# EAGLE design superior-no-branding (EAGLE 9.6.2)
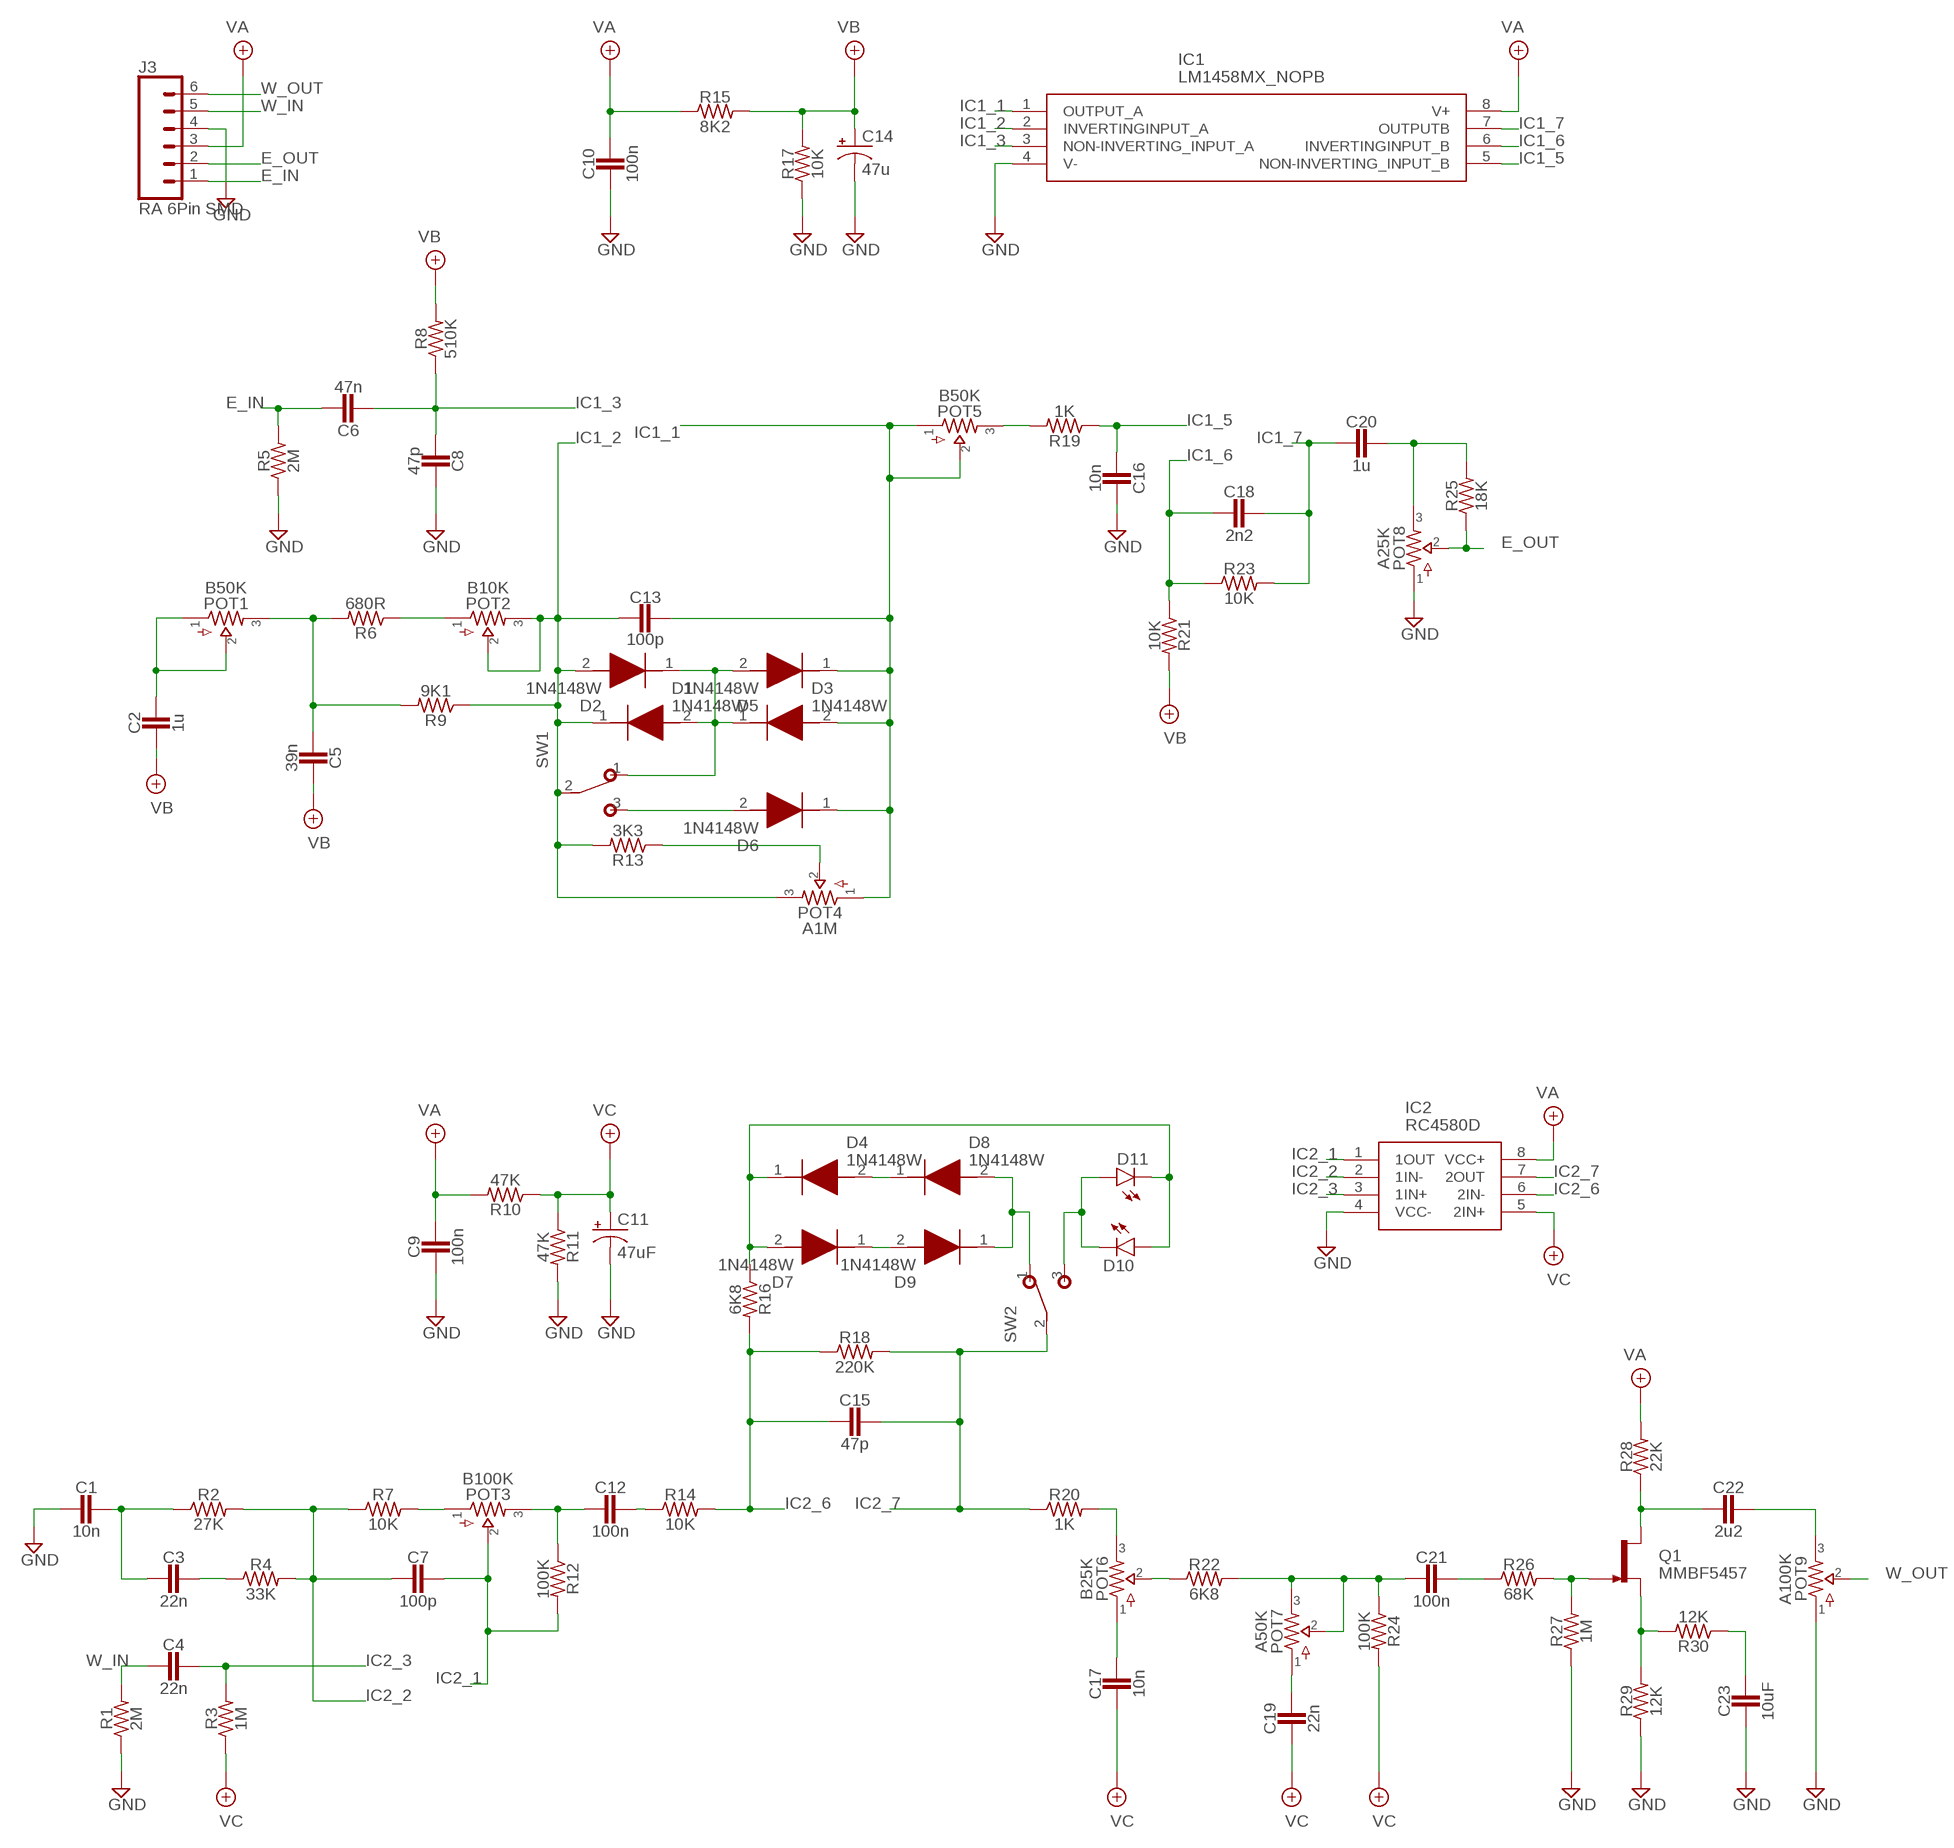
[diagram p0: schematic, sheet 1]

## Parts
C1  10n  CAP0603  [0603]
C2  1u  CAP0805  [0805]
C3  22n  CAP0603  [0603]
C4  22n  CAP0805  [0805]
C5  39n  CAP0603  [0603]
C6  47n  CAP1206  [1206]
C7  100p  CAP0603  [0603]
C8  47p  CAP0603  [0603]
C9  100n  CAP0603  [0603]
C10  100n  CAP0603  [0603]
C11  47uF  0501  [050_020_1]
C12  100n  CAP1206  [1206]
C13  100p  CAP.3  [0.2".MED]
C14  47u  0501  [050_020_1]
C15  47p  CAP0603  [0603]
C16  10n  CAP0603  [0603]
C17  10n  CAP0603  [0603]
C18  2n2  CAP0603  [0603]
C19  22n  CAP0603  [0603]
C20  1u  CAP1206  [1206]
C21  100n  CAP1206  [1206]
C22  2u2  CAP1206  [1206]
C23  10uF  CAP1206  [1206]
D1  1N4148W  [SODFL3816X120N]
D2  1N4148W  [SODFL3816X120N]
D3  1N4148W  [SODFL3816X120N]
D4  1N4148W  [SODFL3816X120N]
D5  1N4148W  [SODFL3816X120N]
D6  1N4148W  [SODFL3816X120N]
D7  1N4148W  [SODFL3816X120N]
D8  1N4148W  [SODFL3816X120N]
D9  1N4148W  [SODFL3816X120N]
D10  LED3MM  [LED3MM]
D11  LED3MM  [LED3MM]
IC1  LM1458MX_NOPB  [SOIC127P600X175-8N]
IC2  RC4580D  NE5532DR  [SOIC127P600X175-8N]
J3  RA 6Pin SMD  CONN_06SILK_FEMALE_PTH  [1X06]
POT1  B50K  16MM.1  [16MM_B.MOUNT]
POT2  B10K  TRIMMER  [TRIM1]
POT3  B100K  16MM.1  [16MM_B.MOUNT]
POT4  A1M  16MM.1  [16MM_B.MOUNT]
POT5  B50K  16MM.1  [16MM_B.MOUNT]
POT6  B25K  16MM.1  [16MM_B.MOUNT]
POT7  A50K  16MM.1  [16MM_B.MOUNT]
POT8  A25K  16MM.1  [16MM_B.MOUNT]
POT9  A100K  16MM.1  [16MM_B.MOUNT]
Q1  MMBF5457  JFET  [SOT23-DGS]
R1  2M  RESISTOR0603  [0603]
R2  27K  RESISTOR0603  [0603]
R3  1M  RESISTOR0603  [0603]
R4  33K  RESISTOR0603  [0603]
R5  2M  RESISTOR0603  [0603]
R6  680R  RESISTOR0603  [0603]
R7  10K  RESISTOR0603  [0603]
R8  510K  RESISTOR0603  [0603]
R9  9K1  RESISTOR0603  [0603]
R10  47K  RESISTOR0603  [0603]
R11  47K  RESISTOR0603  [0603]
R12  100K  RESISTOR0603  [0603]
R13  3K3  RESISTOR0603  [0603]
R14  10K  RESISTOR0603  [0603]
R15  8K2  RESISTOR0603  [0603]
R16  6K8  RESISTOR0603  [0603]
R17  10K  RESISTOR0603  [0603]
R18  220K  RESISTOR0603  [0603]
R19  1K  RESISTOR0603  [0603]
R20  1K  RESISTOR0603  [0603]
R21  10K  RESISTOR0603  [0603]
R22  6K8  RESISTOR0603  [0603]
R23  10K  RESISTOR0603  [0603]
R24  100K  RESISTOR0603  [0603]
R25  18K  RESISTOR0603  [0603]
R26  68K  RESISTOR0603  [0603]
R27  1M  RESISTOR0603  [0603]
R28  22K  RESISTOR0603  [0603]
R29  12K  RESISTOR0603  [0603]
R30  12K  RESISTOR0603  [0603]
SW1  SPDT  [M9040P]
SW2  SPDT  [M9040P]

## Nets
E_IN: C6.1 J3.1 R5.2
E_OUT: J3.2 POT8.2 R25.1
GND: C1.2 C8.1 C9.2 C10.2 C11.- C14.- C16.1 C23.2 IC1.4(V-) IC2.4(VCC-) J3.4 POT8.1 POT9.1 R1.1 R5.1 R11.2 R17.1 R27.1 R29.1
IC1_1: C13.1 D3.2(A) D5.1(K) D6.1(K) IC1.1(OUTPUT_A) POT4.1 POT5.1 POT5.2
IC1_2: C13.2 D1.1(K) D2.2(A) IC1.2(INVERTINGINPUT_A) POT2.2 POT2.3 POT4.3 R9.1 R13.2 SW1.2(P)
IC1_3: C6.2 C8.2 IC1.3(NON-INVERTING_INPUT_A) R8.1
IC1_5: C16.2 IC1.5(NON-INVERTING_INPUT_B) R19.1
IC1_6: C18.2 IC1.6(INVERTINGINPUT_B) R21.1 R23.1
IC1_7: C18.1 C20.2 IC1.7(OUTPUTB) R23.2
IC2_1: C7.1 IC2.1(1OUT) POT3.2 R12.2
IC2_2: C7.2 IC2.2(1IN-) R2.2 R4.2 R7.1
IC2_3: C4.1 IC2.3(1IN+) R3.2
IC2_6: C15.2 IC2.6(2IN-) R14.2 R16.2 R18.1
IC2_7: C15.1 IC2.7(2OUT) R18.2 R20.1 SW2.2(P)
N$5: C5.2 POT1.3 R6.2 R9.2
N$6: POT4.2 R13.1
N$7: C2.1 POT1.1 POT1.2
N$9: POT2.1 R6.1
N$10: D1.2(A) D2.1(K) D3.1(K) D5.2(A) SW1.1(O)
N$12: D6.2(A) SW1.3(S)
N$13: C3.1 R4.1
N$14: POT5.3 R19.2
N$16: C1.1 C3.2 R2.1
N$18: C12.2 POT3.3 R12.1
N$20: C20.1 POT8.3 R25.2
N$21: C12.1 R14.1
N$22: D4.1(K) D7.2(A) D10.A D11.K(C) R16.1
N$23: D4.2(A) D8.1(K)
N$25: D7.1(K) D9.2(A)
N$26: POT6.3 R20.2
N$27: POT6.2 R22.1
N$28: C17.1 POT6.1
N$29: C21.2 POT7.2 POT7.3 R22.2 R24.1
N$30: C21.1 R26.1
N$31: Q1.G R26.2 R27.2
N$32: Q1.S R29.2 R30.2
N$33: C23.1 R30.1
N$34: C22.2 Q1.D R28.1
N$35: C22.1 POT9.3
N$36: D8.2(A) D9.1(K) SW2.1(O)
N$37: D10.K(C) D11.A SW2.3(S)
N$39: C19.1 POT7.1
N$40: POT3.1 R7.2
VA: C9.1 C10.1 IC1.8(V+) IC2.8(VCC+) J3.3 R10.2 R15.1 R28.2
VB: C2.2 C5.1 C14.+ R8.2 R15.2 R17.2 R21.2
VC: C11.+ C17.2 C19.2 IC2.5(2IN+) R3.1 R10.1 R11.1 R24.2
W_IN: C4.2 J3.5 R1.2
W_OUT: J3.6 POT9.2

## Library data of the parts
C1-C10 C12 C15-C23 = superior-no-branding:CAP
C11 C14 = superior-no-branding:050: 0.22 - 100uF Xicon values at Mouser.com: 10V: 10 - 100uF; 16V: 2.2 - 47uF; 25V: 0.47 - 47uF; 50V: 0.22 - 22uF
C13 = superior-no-branding:CAP*?: For Ceramic, Film, MLCC caps
D1-D9 = superior-no-branding:1N4148W: Rectifier Diode Small Signal Switching 100V 0.15A 4ns 2-Pin SOD-123F T/R Source: Datasheet <https://diotec.com/request/datasheet/1n4148w.pdf>; DESCRIPTION: Rectifier Diode Small Signal Switching 100V 0.15A 4ns 2-Pin SOD-123F T/R; HEIGHT: 1.2mm; MANUFACTURER_NAME: Diotec; MANUFACTURER_PART_NUMBER: 1N4148W; MOUSER_PART_NUMBER: 637-1N4148W; MOUSER_PRICE-STOCK: https://www.mouser.co.uk/ProductDetail/Diotec-Semiconductor/1N4148W?qs=OlC7AqGiEDmsbkbAeXQtXg%3D%3D
D10 D11 = superior-no-branding:LED
IC1 = superior-no-branding:LM1458MX_NOPB: Dual 36V general-purpose operational amplifier Source: Datasheet <http://www.ti.com/lit/gpn/lm1458>; DESCRIPTION: Dual 36V general-purpose operational amplifier; HEIGHT: 1.75mm; MANUFACTURER_NAME: Texas Instruments; MANUFACTURER_PART_NUMBER: LM1458MX/NOPB; MOUSER_PART_NUMBER: 926-LM1458MX/NOPB; MOUSER_PRICE-STOCK: https://www.mouser.co.uk/ProductDetail/Texas-Instruments/LM1458MX-NOPB?qs=X1J7HmVL2ZEdp3OcgROSyw%3D%3D
IC2 = superior-no-branding:NE5532DR: NE5532DR, Dual Operational Amplifier 10MHz, 8-Pin SOIC Source: Datasheet <http://www.ti.com/lit/ds/symlink/ne5532.pdf>; DESCRIPTION: NE5532DR, Dual Operational Amplifier 10MHz, 8-Pin SOIC; HEIGHT: 1.75mm; MANUFACTURER_NAME: Texas Instruments; MANUFACTURER_PART_NUMBER: NE5532DR; MOUSER_PART_NUMBER: 595-NE5532DR; MOUSER_PRICE-STOCK: https://www.mouser.co.uk/ProductDetail/Texas-Instruments/NE5532DR?qs=LzFo6vGRJ4tu9UjwVgwNUQ%3D%3D
J3 = superior-no-branding:CONN_06: Multi connection point. Often used as Generic Header-pin footprint for 0.1 inch spaced/style header connections On any of the 0.1 inch spaced packages, you can populate with these: Break Away Headers - Straight <https://www.sparkfun.com/products/116> (PRT-00116) Break Away Male Headers - Right Angle <https://www.sparkfun.com/products/553> (PRT-00553) Female Headers <https://www.sparkfun.com/products/115> (PRT-00115) Break Away Headers - Machine Pin <https://www.sparkfun.com/products/117> (PRT-00117) Break Away Female Headers - Swiss Machine Pin <https://www.sparkfun.com/products/743> (PRT-00743) Arduino Stackable Header - 6 Pin <https://www.sparkfun.com/products/9280> (PRT-09280) For SCREWTERMINALS and SPRING TERMINALS visit here: Screw Terimnals on SparkFun.com <https://www.sparkfun.com/search/results?term=Screw+Terminals> (5mm/3.5mm/2.54mm spacing) This device is also useful as a general connection point to wire up your design to another part of your project. Our various solder wires solder well into these plated through hole pads. Hook-Up Wire - Assortment (Stranded, 22 AWG) <https://www.sparkfun.com/products/11375> (PRT-11375) Hook-Up Wire - Assortment (Solid Core, 22 AWG) <https://www.sparkfun.com/products/11367> (PRT-11367) View the entire wire category on our website here <https://www.sparkfun.com/categories/141>; PROD_ID: CONN-11293; SF_ID: GPS-00579
POT1 POT3-POT9 = superior-no-branding:16MM: 16mm Poteniometers
POT2 = superior-no-branding:TRIMMER: Trimpots
Q1 = superior-no-branding:JFET
R1-R30 = superior-no-branding:RESISTOR
SW1 SW2 = superior-no-branding:SPDT: TOGGLE SWITCH Marquardt

## Board
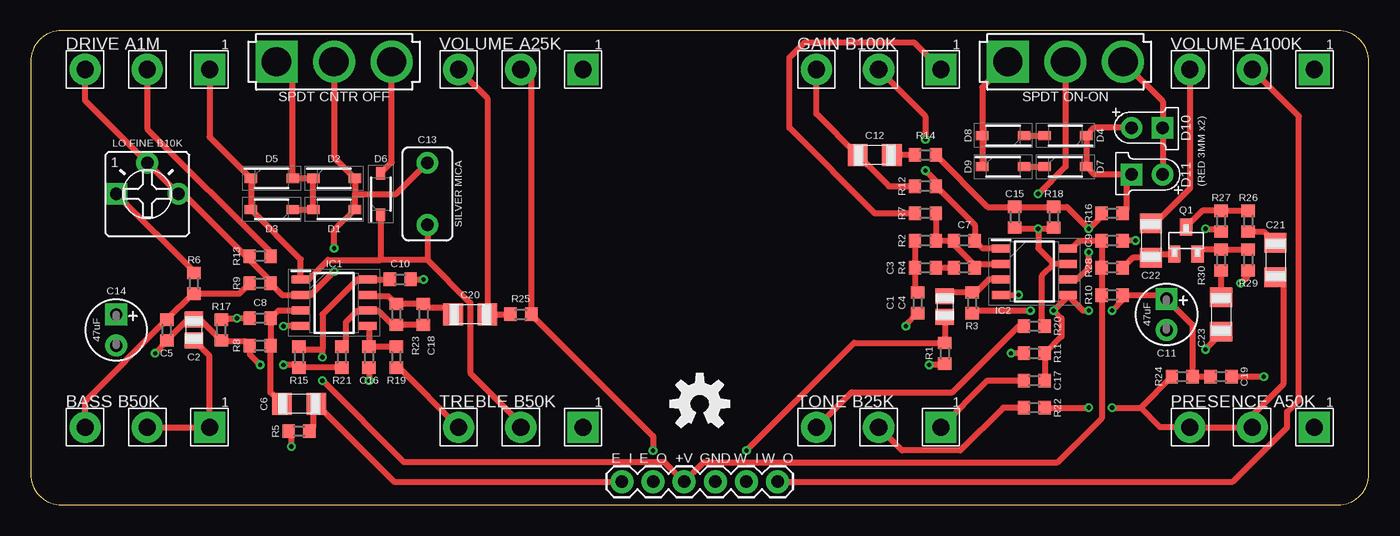
[diagram p1: board, top side]
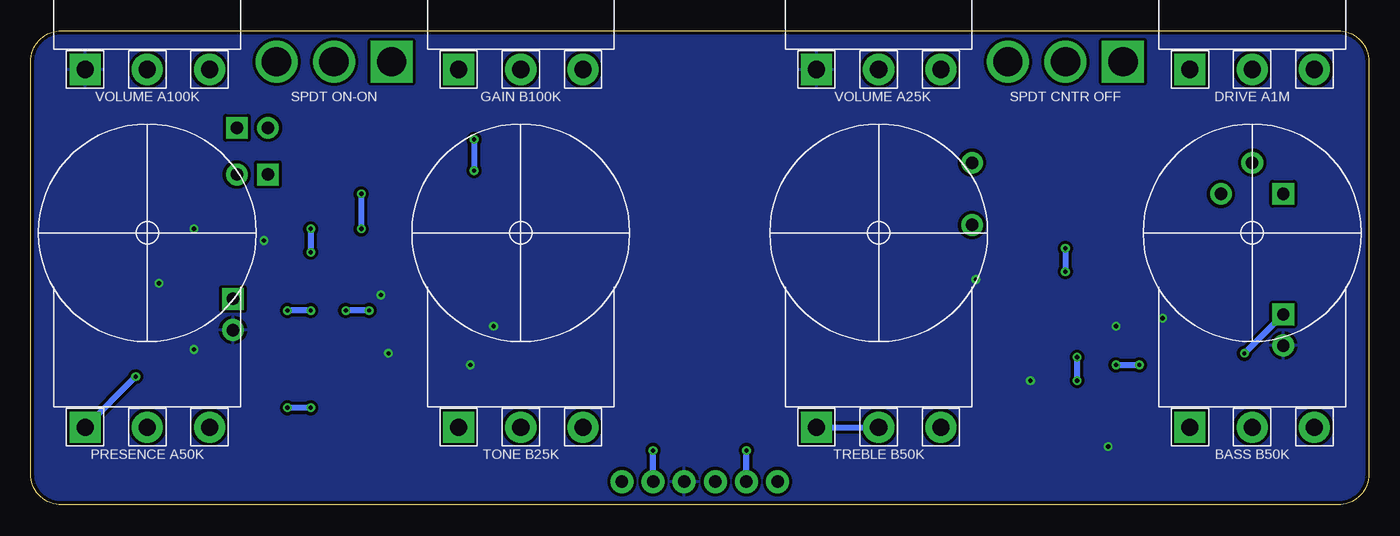
[diagram p2: board, bottom side, seen from below]

Size 109.22 x 38.73 mm. Coordinates in mm from the lower left corner, seen from the top.
Outline: 0,36.2 0,2.54 arc90 2.54,0 106.68,0 arc90 109.22,2.54 109.22,36.2 arc90 106.68,38.73 2.54,38.73 arc90 0,36.2
Copper layers (1*16): Top 0.035mm / dielectric 1.5mm / Bottom 0.035mm
Design rules "SparkFun-2-Layer-General-JLCPCB": minimum track width 7mil, minimum drill 0.3mm, track to track 7mil, track to pad 7mil, pad to pad 7mil, via to via 7mil, smd to smd 7mil, copper to edge 7mil, drill to drill 7mil, minimum pad ring 7mil, minimum via ring 7mil, stop-mask expansion 3mil, vias tented up to drill 25mil, thermal gap 10mil

### Footprints (pad centres in the part's own frame; a part is rotated, then mirrored left to right if it is on the bottom)
0603 = smd 1 x 1.1: 1 -0.85,0; 2 0.85,0
0805 = smd 1.3 x 1.5: 1 -0.85,0; 2 0.85,0
1206 = smd 1.6 x 1.8: 1 -1.4,0; 2 1.4,0
050_020_1 = drill 1.016 pad 1.778 square: + -1.27,0 | drill 1.016 pad 1.778: - 1.27,0
0.2".MED = drill 1.016 pad 1.778: 1 -2.54,0; 2 2.54,0
SODFL3816X120N = smd 1.02 x 0.74: 1 -1.7,0; 2 1.7,0
LED3MM = drill 1.016 pad 1.778: A -1.27,0 | drill 1.016 pad 1.778 square: K 1.27,0
SOIC127P600X175-8N = smd 1.528 x 0.65: 1 -2.711,1.905; 2 -2.711,0.635; 3 -2.711,-0.635; 4 -2.711,-1.905; 5 2.711,-1.905; 6 2.711,-0.635; 7 2.711,0.635; 8 2.711,1.905
1X06 = drill 1.016 pad 1.88: 1 0,0; 2 2.54,0; 3 5.08,0; 4 7.62,0; 5 10.16,0; 6 12.7,0
16MM_B.MOUNT = drill 1.4 pad 2.54 square: 1 5.08,0 | drill 1.4 pad 2.54: 2 0,0; 3 -5.08,0
TRIM1 = drill 1.016 pad 1.778 square: 1 -2.54,0 | drill 1.016 pad 1.778: 2 0,2.54; 3 2.54,0
SOT23-DGS = smd 1 x 1.4: D -0.95,-1.1; G 0,1.1; S 0.95,-1.1
M9040P = drill 2.4 square: 1 0,4.699 | drill 2.4: 2 0,0; 3 0,-4.699

### Placement (x,y rotation side)
C1  72.39,16.51 270 top
C2  13.34,14.29 90 top
C3  73.03,19.37 180 top
C4  74.61,16.19 270 top
C5  11.11,14.29 90 top
C6  21.91,8.26 180 top
C7  76.2,21.59 180 top
C8  18.73,15.24 0 top
C9  88.27,21.59 0 top
C10  30.16,18.41 0 top
C11  92.71,15.56 270 top
C12  68.9,28.57 180 top
C13  32.38,25.4 90 top
C14  6.99,14.29 270 top
C15  80.33,23.5 90 top
C16  27.62,12.06 90 top
C17  81.92,10.16 0 top
C18  32.07,15.56 270 top
C19  97.16,10.48 180 top
C20  35.88,15.56 180 top
C21  101.6,20 270 top
C22  91.44,21.59 270 top
C23  97.16,15.56 270 top
D1  24.77,24.13 180 top
D2  24.77,26.67 0 top
D3  19.68,24.13 180 top
D4  84.45,30.16 180 top
D5  19.68,26.67 0 top
D6  28.57,25.4 90 top
D7  84.45,27.62 0 top
D8  79.38,30.16 180 top
D9  79.38,27.62 0 top
D10  91.12,30.8 0 top
D11  91.12,26.99 180 top
IC1  24.77,16.51 0 top
IC2  81.92,19.05 0 top
J3  48.26,1.91 0 top
POT1  9.53,6.35 0 top
POT2  9.53,25.4 0 top
POT3  69.22,35.56 0 top
POT4  9.53,35.56 0 top
POT5  40.01,6.35 0 top
POT6  69.22,6.35 0 top
POT7  99.69,6.35 0 top
POT8  40.01,35.56 0 top
POT9  99.69,35.56 0 top
Q1  94.3,21.59 0 top
R1  74.61,12.38 90 top
R2  73.03,21.59 0 top
R3  76.83,16.51 90 top
R4  76.2,19.37 0 top
R5  21.91,6.03 0 top
R6  13.34,18.1 270 top
R7  73.03,23.81 180 top
R8  18.73,13.02 180 top
R9  18.73,18.1 180 top
R10  88.27,17.14 180 top
R11  81.92,12.38 180 top
R12  73.03,26.04 0 top
R13  18.73,20.32 180 top
R14  73.03,28.57 0 top
R15  21.91,12.06 270 top
R16  88.27,23.81 180 top
R17  15.56,14.29 270 top
R18  83.5,23.5 270 top
R19  29.84,12.06 270 top
R20  81.92,14.61 180 top
R21  25.4,12.06 270 top
R22  81.92,7.94 0 top
R23  29.84,15.56 90 top
R24  93.98,10.48 0 top
R25  40.01,15.56 180 top
R26  99.38,23.18 90 top
R27  97.16,23.18 90 top
R28  88.27,19.37 180 top
R29  99.38,20 90 top
R30  97.16,20 90 top
SW1  24.77,36.2 90 top
SW2  84.45,36.2 90 top
U$3  [OSHW-LOGO-M]  54.61,8.26 0 top

### Tracks (layer width: path | path; a pad name or v marks a point on that pad's centre or on a via)
E_IN
  Top 0.508: R5.2 23.07,6.35 23.07,8.02 C6.1 29.66,1.91 J3.1
E_OUT  (via drill 0.35)
  Top 0.508: POT8.2 40.85,34.71 R25.1 50.8,5.61 v50.8,4.45
  Bottom 0.508: J3.2 v50.8,4.45
GND  (via drill 0.35)
  Top 0.508: C10.2 v32.07,18.41 | C16.1 v27.62,10.16 | C8.1 v16.83,15.24 15.66,15.24 R17.1 | IC1.4 v20.64,14.61 | C1.2 71.44,14.71 v71.44,14.61 | IC2.4 v80.64,17.14 | v90.17,21.59 C9.2 | R11.2 v80.01,12.38 | R1.1 74.51,11.43 v73.34,11.43 | v95.89,22.54 96.94,22.54 R27.1 | R5.1 21.27,5.82 v21.27,4.76 | C23.2 97.16,13.97 v95.89,12.7 | R29.1 99.38,18.73 v98.74,18.1
  pour Bottom (isolate 0.254): 0,19.05 0,36.2 arc-90 2.54,38.73 48.26,38.73 106.68,38.73 arc-90 109.22,36.2 109.22,10.16 109.22,2.54 arc-90 106.68,0 16.51,0 2.54,0 arc-90 0,2.54
IC1_1
  Top 0.508: POT4.1 14.61,30.05 D5.1 D3.2 22.05,20.06 IC1.1 22.69,18.41 24.28,20 28.57,20 | 32.38,20 28.57,20 | POT5.2 40.01,6.67 35.88,10.79 35.88,16.51 32.38,20 | C13.1 32.38,20 | D6.1 28.57,20
  Bottom 0.508: POT5.1 POT5.2
IC1_2  (via drill 0.35)
  Top 0.508: SW1.2 24.77,28.37 D2.2 26.46,25.4 | v24.77,19.05 22.86,17.14 IC1.2 20.54,17.14 R9.1 19.58,18.3 17.88,20 R13.2 17.57,20.32 12.48,25.4 POT2.3 POT2.2 4.45,33.02 POT4.3 | v24.77,20.95 24.77,22.43 D1.1 26.46,25.4 | 26.46,25.4 29.84,25.4 C13.2
  Bottom 0.508: v24.77,20.95 v24.77,19.05
IC1_3
  Top 0.508: IC1.3 20.22,15.88 C8.2 R8.1 19.58,9.18 C6.2
IC1_5
  Top 0.508: IC1.5 27.62,14.46 C16.2 R19.1
IC1_6
  Top 0.508: C18.2 R23.1 29.53,14.71 28.36,15.88 IC1.6 26.67,15.88 25.72,14.92 25.72,13.23 R21.1
IC1_7
  Top 0.508: IC1.7 27.58,17.04 29.21,17.04 R23.2 C18.1 32.38,16.09 33.95,16.09 C20.2
IC2_1  (via drill 0.35)
  Top 0.508: IC2.1 77.69,20.95 C7.1 77.05,22.86 R12.2 73.88,26.45 v73.03,27.3 | POT3.2 73.03,31.75 v73.03,29.84
  Bottom 0.508: v73.03,29.84 v73.03,27.3
IC2_2
  Top 0.508: R7.1 R2.2 C7.2 75.35,21.27 77.05,19.57 R4.2 77.37,19.68 IC2.2
IC2_3
  Top 0.508: C4.1 74.93,17.36 R3.2 77.15,17.36 78.21,18.41 IC2.3
IC2_6  (via drill 0.35)
  Top 0.508: IC2.6 85.41,18.41 86.36,19.37 v86.36,20.64 | R14.2 78.11,24.34 C15.2 R18.1 84.56,24.34 v86.36,22.54 87.42,23.6 R16.2
  Bottom 0.508: v86.36,22.54 v86.36,20.64
IC2_7  (via drill 0.35)
  Top 0.508: R20.1 82.55,14.82 82.55,18.73 83.5,19.68 | 83.5,19.68 82.23,20.95 v82.23,22.54 | SW2.2 84.45,27.62 v82.23,25.4 | IC2.7 83.5,19.68 | C15.1 80.43,22.54 v82.23,22.54 | R18.2 83.4,22.54 v82.23,22.54
  Bottom 0.508: v82.23,25.4 v82.23,22.54
N$5
  Top 0.508: POT1.3 4.45,8.47 C5.2 13.22,17.25 R6.2 17.03,17.25 R9.2
N$6
  Top 0.508: POT4.2 9.53,30.7 19.58,20.64 R13.1
N$7
  Top 0.508: POT1.2 POT1.1 14.61,12.17 C2.1
N$9
  Top 0.508: R6.1 13.34,19.05 POT2.1
N$10
  Top 0.508: SW1.1 21.34,34.92 21.34,26.72 D5.2 D2.1 D1.2 D3.1
N$12
  Top 0.508: D6.2 29.46,27.99 SW1.3
N$13
  Top 0.508: R4.1 C3.1
N$14
  Top 0.508: R19.2 30.06,11.21 POT5.3
N$16
  Top 0.508: R2.1 C3.2 72.17,17.57 C1.1
N$18
  Top 0.508: R12.1 70.04,26.04 C12.2 64.14,31.94 POT3.3
N$20
  Top 0.508: POT8.3 37.28,33.21 C20.1 R25.2
N$21
  Top 0.508: R14.1 C12.1
N$22
  Top 0.508: D10.A 86.79,30.8 D4.1 D7.2 86.79,26.99 D11.K 89.43,26.57 89.43,24.13 R16.1
N$23
  Top 0.508: D8.1 D4.2
N$25
  Top 0.508: D9.2 D7.1
N$26
  Top 0.508: POT6.3 66.99,9.21 75.25,9.21 80.64,14.61 R20.2
N$27
  Top 0.508: POT6.2 71.12,4.45 75.88,4.45 79.38,7.94 R22.1
N$28
  Top 0.508: POT6.1 78.11,10.16 C17.1
N$29  (via drill 0.35)
  Top 0.508: R22.2 v86.36,7.94 | C21.2 102.23,17.97 102.23,9.84 99.69,7.3 POT7.2 POT7.3 92.18,6.35 90.59,7.94 | v88.27,7.94 90.59,7.94 | 90.59,7.94 R24.1
  Bottom 0.508: v86.36,7.94 v88.27,7.94
N$30
  Top 0.508: R26.1 100.67,22.33 C21.1
N$31
  Top 0.508: R26.2 R27.2 95.64,24.03 Q1.G
N$32
  Top 0.508: R29.2 R30.2 95.61,20.85 Q1.S
N$33
  Top 0.508: R30.1 C23.1
N$34
  Top 0.508: R28.1 89.94,20.19 C22.2 91.74,20.49 Q1.D
N$35
  Top 0.508: POT9.3 94.61,25.85 91.76,22.99 C22.1
N$36
  Top 0.508: D9.1 D8.2 77.67,34.11 SW2.1
N$37
  Top 0.508: SW2.3 92.39,32.96 D10.K D11.A
N$39  (via drill 0.35)
  Top 0.508: C19.1 v100.65,10.48
  Bottom 0.508: POT7.1 v100.65,10.48
N$40
  Top 0.508: R7.2 68.9,23.81 61.91,30.8 61.91,36.51 63.18,37.78 72.07,37.78 POT3.1
VA  (via drill 0.35)
  Top 0.508: 23.81,12.7 23.81,15.56 26.67,18.41 IC1.8 C10.1 | v23.81,12.06 23.81,12.7 | v23.81,10.16 30.48,3.49 51.75,3.49 J3.3 54.93,3.49 83.82,3.49 87.42,7.09 R10.2 R28.2 C9.1 85.58,21.59 84.94,20.95 IC2.8 | R15.1 22.12,12.7 23.81,12.7
  Bottom 0.508: v23.81,12.06 v23.81,10.16
VB  (via drill 0.35)
  Top 0.508: R21.2 R15.2 21.69,11.43 v20.64,11.43 | v18.73,11.43 17.88,12.28 R8.2 17.57,13.34 15.66,13.34 R17.2 13.86,15.14 C2.2 12.81,15.14 C5.1 11.11,13.34 v10.16,12.38
  Bottom 0.508: v20.64,11.43 v18.73,11.43 | C14.+ v10.16,12.38
VC  (via drill 0.35)
  Top 0.508: C17.2 R11.1 84.14,13.76 84.14,15.24 v83.5,15.88 84.63,17 IC2.5 85.9,15.88 v86.36,15.88 | v81.6,15.88 77.05,15.88 R3.1 | v88.27,15.88 89.11,16.73 R10.1 92.39,17.14 C11.+ 94.83,14.71 R24.2 C19.2
  Bottom 0.508: v86.36,15.88 v88.27,15.88 | v81.6,15.88 v83.5,15.88
W_IN  (via drill 0.35)
  Top 0.508: C4.2 R1.2 67.21,13.23 v58.42,4.45
  Bottom 0.508: J3.5 v58.42,4.45
W_OUT
  Top 0.508: POT9.2 103.5,31.75 103.5,8.57 102.55,7.62 102.55,6.35 98.11,1.91 J3.6

### Text on the board
tPlace: DRIVE A1M | VOLUME A25K | GAIN B100K | VOLUME A100K | SPDT CNTR OFF | SPDT ON-ON | D10 | LO FINE B10K | (RED 3MM x2) | D11 | SILVER MICA | C14 | 47uF | 47uF | C11 | BASS B50K | TREBLE B50K | TONE B25K | PRESENCE A50K | E_I | E_O | +V | GND | W_I | W_O
bNames: DRIVE A1M | SPDT CNTR OFF | VOLUME A25K | GAIN B100K | SPDT ON-ON | VOLUME A100K | BASS B50K | TREBLE B50K | TONE B25K | PRESENCE A50K